# EAGLE design untitled (EAGLE 8.1.1)
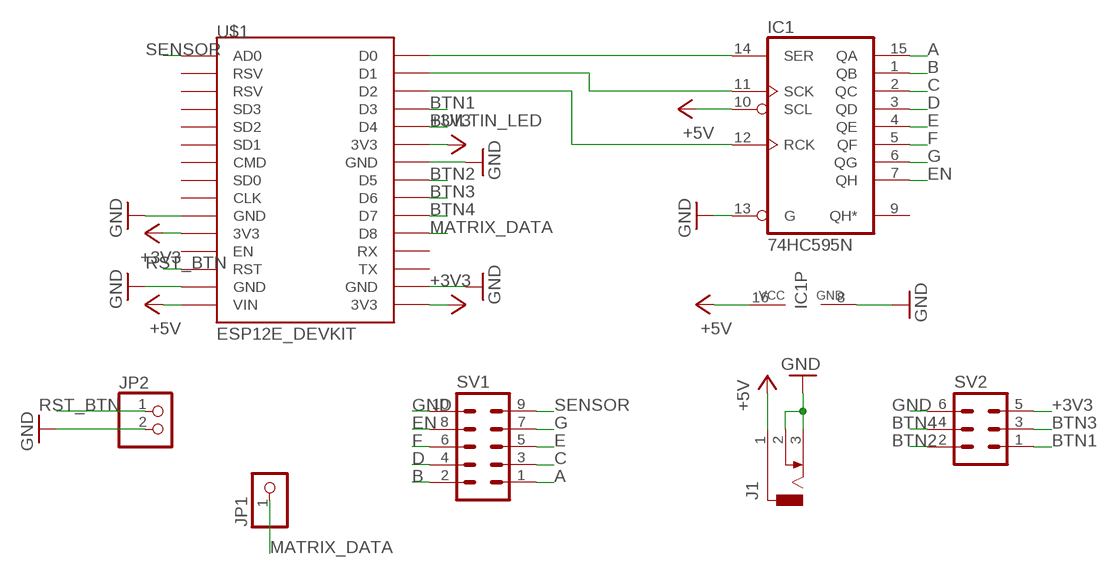
[diagram p0: schematic, sheet 1]

## Parts
IC1  74HC595N  [DIL16]
J1  DCJ0303  [DCJ0303]
JP1  PINHD-1X1  [1X01]
JP2  PINHD-1X2  [1X02]
SV1  ML10  [ML10]
SV2  ML6  [ML6]
U$1  ESP12E_DEVKIT  [ESP12E_DEVKIT]

## Nets
+3V3: SV2.5 U$1.3V3@0(3V3) U$1.3V3@1(3V3) U$1.3V3@2(3V3)
+5V: IC1.10(SCL) IC1.16(VCC) J1.1 U$1.VIN
A: IC1.15(QA) SV1.1
B: IC1.1(QB) SV1.2
BTN1: SV2.1 U$1.D3
BTN2: SV2.2 U$1.D5
BTN3: SV2.3 U$1.D6
BTN4: SV2.4 U$1.D7
BUILTIN_LED: U$1.D4
C: IC1.2(QC) SV1.3
D: IC1.3(QD) SV1.4
E: IC1.4(QE) SV1.5
EN: IC1.7(QH) SV1.8
F: IC1.5(QF) SV1.6
G: IC1.6(QG) SV1.7
GND: IC1.8(GND) IC1.13(G) J1.2 J1.3 JP2.2 SV1.10 SV2.6 U$1.GND@0(GND) U$1.GND@1(GND) U$1.GND@2(GND) U$1.GND@3(GND)
MATRIX_DATA: JP1.1 U$1.D8
N$9: IC1.14(SER) U$1.D0
N$10: IC1.11(SCK) U$1.D1
N$11: IC1.12(RCK) U$1.D2
RST_BTN: JP2.1 U$1.RST
SENSOR: SV1.9 U$1.AD0
Unconnected: IC1.9(QH*) U$1.CLK U$1.CMD U$1.EN U$1.RSV@0(RSV) U$1.RSV@1(RSV) U$1.RX U$1.SD0 U$1.SD1 U$1.SD2 U$1.SD3 U$1.TX

## Library data of the parts
IC1 = 74xx-eu:74*595: 8-bit SHIFT REGISTER, output latch
J1 = con-jack:DCJ0303: DC POWER JACK Source: DCJ0303.pdf; OC_FARNELL: unknown; OC_NEWARK: unknown
JP1 = pinhead:PINHD-1X1: PIN HEADER
JP2 = pinhead:PINHD-1X2: PIN HEADER
SV1 = con-harting-ml:ML10: HARTING; OC_FARNELL: unknown; OC_NEWARK: unknown
SV2 = con-harting-ml:ML6: HARTING; OC_FARNELL: unknown; OC_NEWARK: unknown
U$1 = nodemcuv3:ESP12E_DEVKIT: ESP12E DEVKIT BOARD

## Net classes
0 default: clearance 0.205 mm

## Board
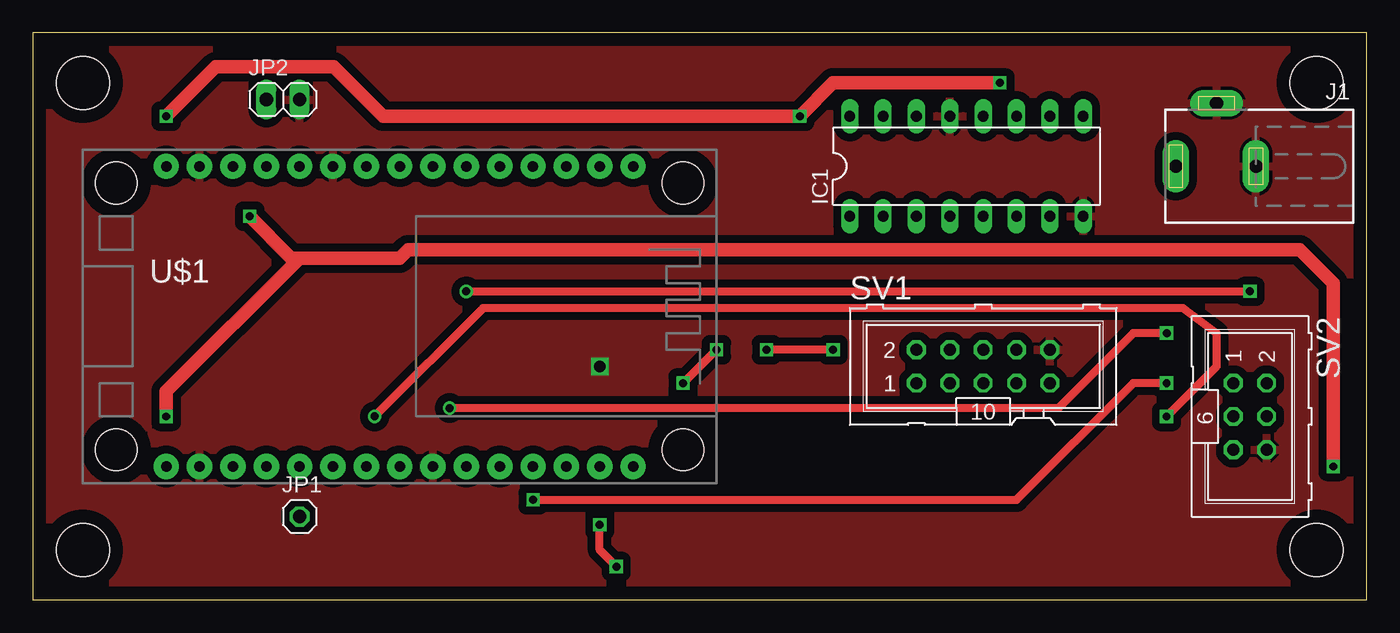
[diagram p1: board, top side]
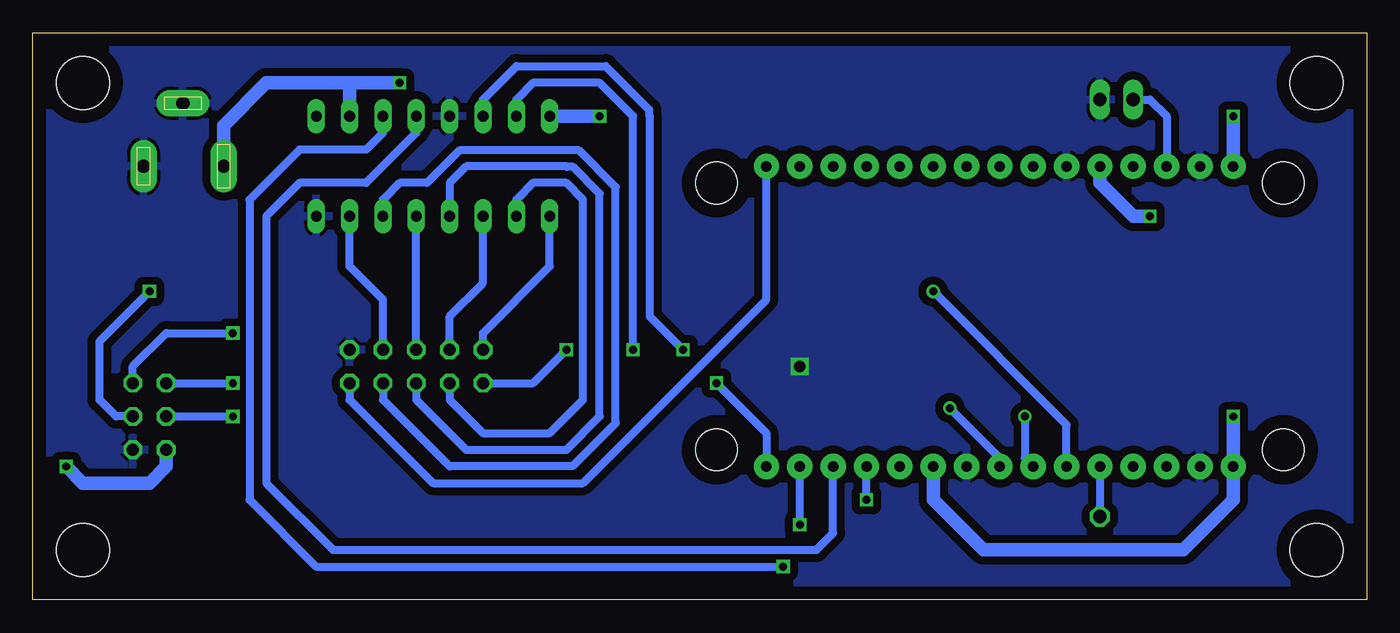
[diagram p2: board, bottom side, seen from below]

Size 101.6 x 43.18 mm. Coordinates in mm from the lower left corner, seen from the top.
Outline: 0,0 101.6,0 101.6,43.18 0,43.18 0,0
Copper layers (1*16): Top 0.035mm / dielectric 1.5mm / Bottom 0.035mm
Design rules "default *": minimum track width 24mil, minimum drill 24mil, track to track 24mil, track to pad 24mil, pad to pad 24mil, via to via 24mil, smd to smd 8mil, copper to edge 40mil, drill to drill 8mil, minimum pad ring 10mil, minimum via ring 8mil, stop-mask expansion 4mil, vias tented up to drill 0mil, thermal gap 10mil
Holes 4.06 mm at 3.81,39.37 3.81,3.81 97.79,39.37 97.79,3.81

### Footprints (pad centres in the part's own frame; a part is rotated, then mirrored left to right if it is on the bottom)
DIL16 = drill 0.813 long: 1 -8.89,-3.81; 2 -6.35,-3.81; 3 -3.81,-3.81; 4 -1.27,-3.81; 5 1.27,-3.81; 6 3.81,-3.81; 7 6.35,-3.81; 8 8.89,-3.81; 9 8.89,3.81; 10 6.35,3.81; 11 3.81,3.81; 12 1.27,3.81; 13 -1.27,3.81; 14 -3.81,3.81; 15 -6.35,3.81; 16 -8.89,3.81
DCJ0303 = drill 1 pad 2 long: 1 0,3.1; 2 4.8,0; 3 0,-3
1X01 = drill 1.016 octagon: 1 0,0
1X02 = drill 1.016 long: 1 -1.27,0; 2 1.27,0
ML10 = drill 0.914 octagon: 1 -5.08,-1.27; 2 -5.08,1.27; 3 -2.54,-1.27; 4 -2.54,1.27; 5 0,-1.27; 6 0,1.27; 7 2.54,-1.27; 8 2.54,1.27; 9 5.08,-1.27; 10 5.08,1.27
ML6 = drill 0.914 octagon: 1 -2.54,-1.27; 2 -2.54,1.27; 3 0,-1.27; 4 0,1.27; 5 2.54,-1.27; 6 2.54,1.27
ESP12E_DEVKIT = drill 0.8 pad 1.93: 3V3@0 -11.43,-7.62; 3V3@1 11.43,5.08; 3V3@2 11.43,-17.78; AD0 -11.43,17.78; CLK -11.43,-2.54; CMD -11.43,2.54; D0 11.43,17.78; D1 11.43,15.24; D2 11.43,12.7; D3 11.43,10.16; D4 11.43,7.62; D5 11.43,0; D6 11.43,-2.54; D7 11.43,-5.08; D8 11.43,-7.62; EN -11.43,-10.16; GND@0 -11.43,-5.08; GND@1 -11.43,-15.24; GND@2 11.43,2.54; GND@3 11.43,-15.24; RST -11.43,-12.7; RSV@0 -11.43,15.24; RSV@1 -11.43,12.7; RX 11.43,-10.16; SD0 -11.43,0; SD1 -11.43,5.08; SD2 -11.43,7.62; SD3 -11.43,10.16; TX 11.43,-12.7; VIN -11.43,-17.78 | hole 3.2: -10.16,21.59; 10.16,21.59; 10.16,-21.59; -10.16,-21.59

### Placement (x,y rotation side)
IC1  71.12,33.02 0 top
J1  90.17,33.02 90 top
JP1  20.32,6.35 0 top
JP2  19.05,38.1 0 top
SV1  72.39,17.78 0 top
SV2  92.71,13.97 270 top
U$1  27.94,21.59 270 top

### Tracks (layer width: path | path; a pad name or v marks a point on that pad's centre or on a via)
+3V3  (via drill 0.6)
  Top 1.016: 20.32,26.04 27.94,26.04 28.57,26.67 96.52,26.67 99.06,24.13 v99.06,10.16 | 20.32,26.04 10.16,15.88 v10.16,13.97 | 20.32,26.04 19.68,26.04 v16.51,29.21
  Bottom 1.016: SV2.5 91.44,10.16 92.71,8.89 97.79,8.89 v99.06,10.16 | U$1.3V3@1 33.02,7.62 29.21,3.81 13.97,3.81 10.16,7.62 U$1.3V3@2 v10.16,13.97 | v16.51,29.21 17.78,29.21 20.32,31.75 U$1.3V3@0
+5V  (via drill 0.6)
  Top 1.016: v10.16,36.83 13.92,40.59 22.91,40.59 26.67,36.83 v58.42,36.83 60.96,39.37 v73.66,39.37
  Bottom 1.016: IC1.16 v58.42,36.83 | J1.1 87.07,36.12 83.82,39.37 77.47,39.37 | v10.16,36.83 U$1.VIN | IC1.10 77.47,39.37 | 77.47,39.37 v73.66,39.37
A  (via drill 0.6)
  Top 0.61: v60.96,19.05 v55.88,19.05
  Bottom 0.61: SV1.1 63.5,16.51 v60.96,19.05 | IC1.15 64.77,38.1 63.5,39.37 58.42,39.37 55.88,36.83 v55.88,19.05
B
  Bottom 0.61: SV1.2 67.31,20.32 62.23,25.4 IC1.1
BTN1  (via drill 0.6)
  Top 0.61: v86.36,16.51 83.82,16.51 74.93,7.62 v38.1,7.62
  Bottom 0.61: SV2.1 v86.36,16.51 | v38.1,7.62 U$1.D3
BTN2  (via drill 0.61)
  Top 0.61: v31.75,14.61 78.11,14.61 83.82,20.32 v86.36,20.32
  Bottom 0.61: v31.75,14.61 27.94,10.79 U$1.D5 | SV2.2 93.98,17.78 91.44,20.32 v86.36,20.32
BTN3  (via drill 0.6, 0.61)
  Top 0.61: v26.04,13.97 34.29,22.23 87.63,22.23 90.17,20.32 90.17,17.78 v86.36,13.97
  Bottom 0.61: SV2.3 v86.36,13.97 | U$1.D6 26.04,10.79 v26.04,13.97
BTN4  (via drill 0.6, 0.61)
  Top 0.61: v33.02,23.5 v92.71,23.5
  Bottom 0.61: v33.02,23.5 22.86,13.34 U$1.D7 | SV2.4 95.25,13.97 96.52,15.24 96.52,19.68 v92.71,23.5
C
  Bottom 0.61: SV1.3 69.85,15.24 67.31,12.7 62.23,12.7 59.69,15.24 59.69,30.48 60.96,31.75 63.5,31.75 64.77,30.48 IC1.2
D
  Bottom 0.61: SV1.4 69.85,21.59 67.31,24.13 IC1.3
E
  Bottom 0.61: SV1.5 72.39,15.24 68.58,11.43 60.96,11.43 58.42,13.97 58.42,30.93 60.45,32.97 60.91,32.97 60.96,33.02 68.58,33.02 69.85,31.75 IC1.4
EN
  Bottom 0.61: SV1.8 74.93,22.86 77.47,25.4 IC1.7
F
  Bottom 0.61: SV1.6 IC1.5
G
  Bottom 0.61: SV1.7 74.93,15.24 69.85,10.16 69.8,10.21 60.45,10.21 57.2,13.46 57.2,31.44 60,34.24 69.08,34.24 71.57,31.75 73.66,31.75 74.93,30.48 IC1.6
GND  (via drill 0.9)
  other vias: 43.18,17.78
  pour Top: 101.6,43.18 101.6,0 0,0 0,43.18
  pour Bottom: 0,43.18 101.6,43.18 101.6,0 0,0
MATRIX_DATA
  Bottom 0.61: U$1.D8 JP1.1
N$9  (via drill 0.6)
  Top 0.61: v52.07,19.05 v49.53,16.51
  Bottom 0.61: IC1.14 67.31,38.1 64.77,40.64 57.97,40.64 54.66,37.34 54.66,36.88 54.61,36.83 54.61,21.59 v52.07,19.05 | v49.53,16.51 45.72,12.7 U$1.D0
N$10  (via drill 0.6)
  Top 0.61: v44.45,2.54 43.18,3.81 v43.18,5.71
  Bottom 0.61: IC1.11 74.93,35.56 76.2,34.29 81.28,34.29 85.09,30.48 85.09,7.62 80.01,2.54 v44.45,2.54 | v43.18,5.71 U$1.D1
N$11
  Bottom 0.61: IC1.12 72.39,35.56 76.2,31.75 81.28,31.75 83.82,29.21 83.82,8.89 78.74,3.81 41.91,3.81 40.64,5.08 U$1.D2
RST_BTN
  Bottom 0.61: JP2.1 16.51,38.1 15.24,36.83 U$1.RST
SENSOR
  Bottom 0.61: U$1.AD0 45.72,22.86 59.69,8.89 71.12,8.89 77.47,15.24 SV1.9